# EAGLE design AE-UM232R (EAGLE 5.10)
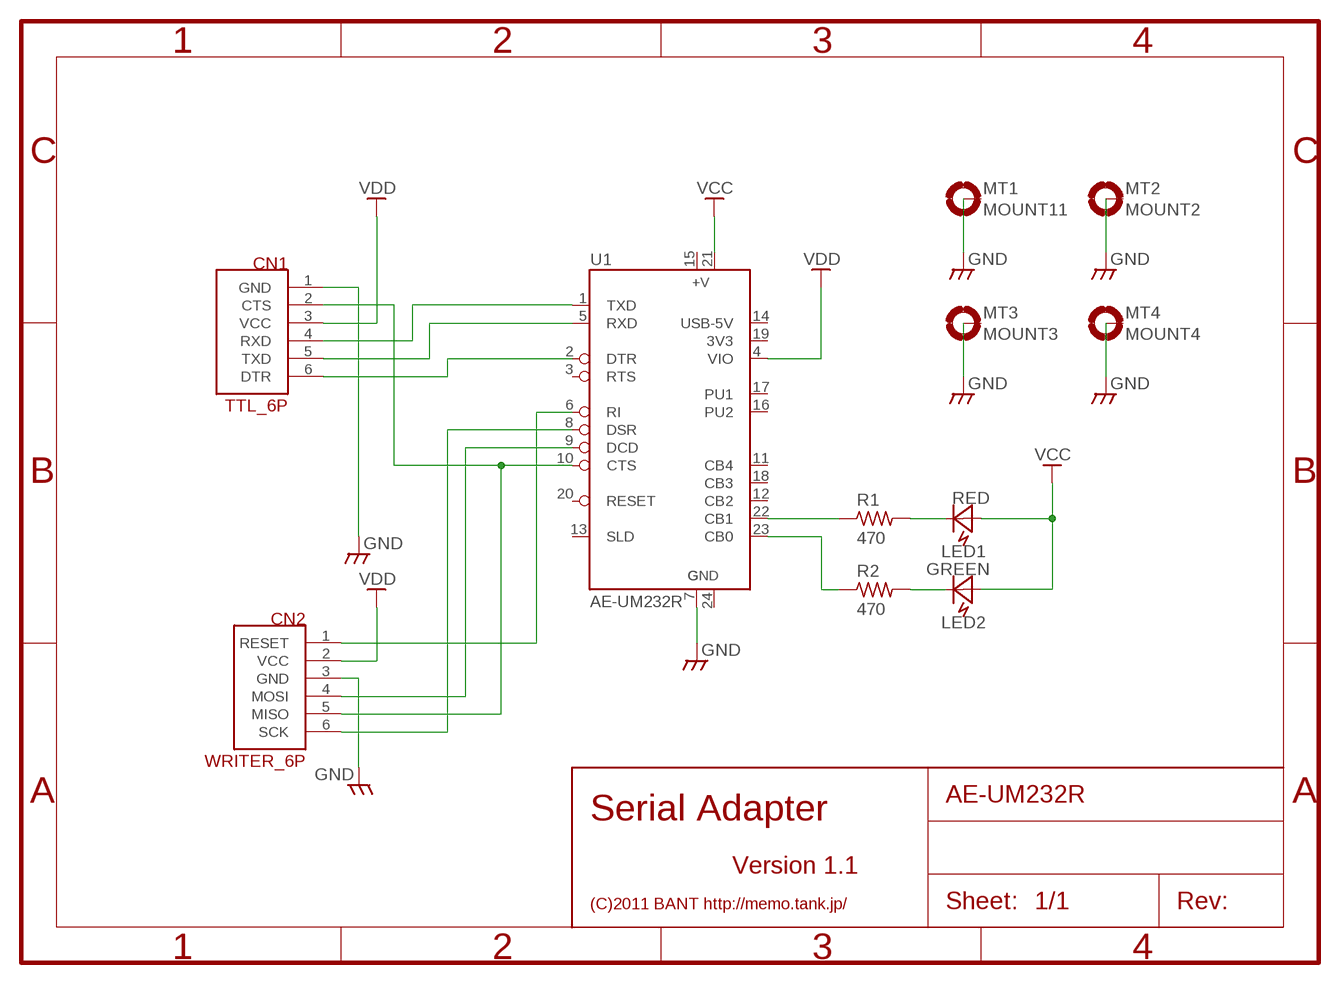
[diagram p0: schematic, sheet 1]

## Parts
CN1  TTL_6P  ARDUINO_TTL_6P  [CON_HRS_DIP_6]
CN2  WRITER_6P  HIDASPX_CON_6P  [CON_HRS_DIP_6]
LED1  RED  LED  [LED_3MM_VIRT_2]
LED2  GREEN  LED  [LED_3MM_VIRT_2]
MT1  MOUNT11  MOUNT-PAD2.1  [PAD-2.1]
MT2  MOUNT2  MOUNT-PAD2.1  [PAD-2.1]
MT3  MOUNT3  MOUNT-PAD2.1  [PAD-2.1]
MT4  MOUNT4  MOUNT-PAD2.1  [PAD-2.1]
R1  470  R0.125W_4P  [R_0.125W_4]
R2  470  R0.125W_4P  [R_0.125W_4]
U1  AE-UM232R  [DIL24-6]

## Nets
GND: CN1.1(GND) CN2.3(GND) MT1.B2,1(MOUNT) MT2.B2,1(MOUNT) MT3.B2,1(MOUNT) MT4.B2,1(MOUNT) U1.7(GND)
N$1: R1.1 U1.22(CB1)
N$2: CN2.6(SCK) U1.8(DSR)
N$3: CN1.2(CTS) CN2.5(MISO) U1.10(CTS)
N$4: CN1.6(DTR) U1.2(DTR)
N$7: CN2.1(RESET) U1.6(RI)
N$8: CN2.4(MOSI) U1.9(DCD)
N$10: LED1.K R1.2
N$11: R2.1 U1.23(CB0)
N$12: LED2.K R2.2
N$13: CN1.5(TXD) U1.5(RXD)
N$14: CN1.4(RXD) U1.1(TXD)
VCC: LED1.A LED2.A U1.21(VCC)
VDD: CN1.3(VCC) CN2.2(VCC) U1.4(VIO)
Unconnected: U1.3(RTS) U1.11(CB4) U1.12(CB2) U1.13(SLD) U1.14(USB-5V) U1.15(VCC) U1.16(PU2) U1.17(PU1) U1.18(CB3) U1.19(3V3) U1.20(RESET) U1.24(GND)

## Notes on the sheet
- Serial Adapter
- Version 1.1
- (C)2011 BANT http://memo.tank.jp/

## Library data of the parts
CN1 = bant2:ARDUINO_TTL_6P
CN2 = bant:HIDASPX_CON_6P
LED1 LED2 = MyLib:LED: 3mm LED
MT1-MT4 = MyLib:MOUNT-PAD: 2.1mm Mount Pad (Connectable to GND)
R1 R2 = MyLib:R: General Resiter 1/8W 1/4W 1/2W V/H
U1 = akizuki:AE-UM232R: Akizuki USB-Serial Converter (TTL-Level)

## Board
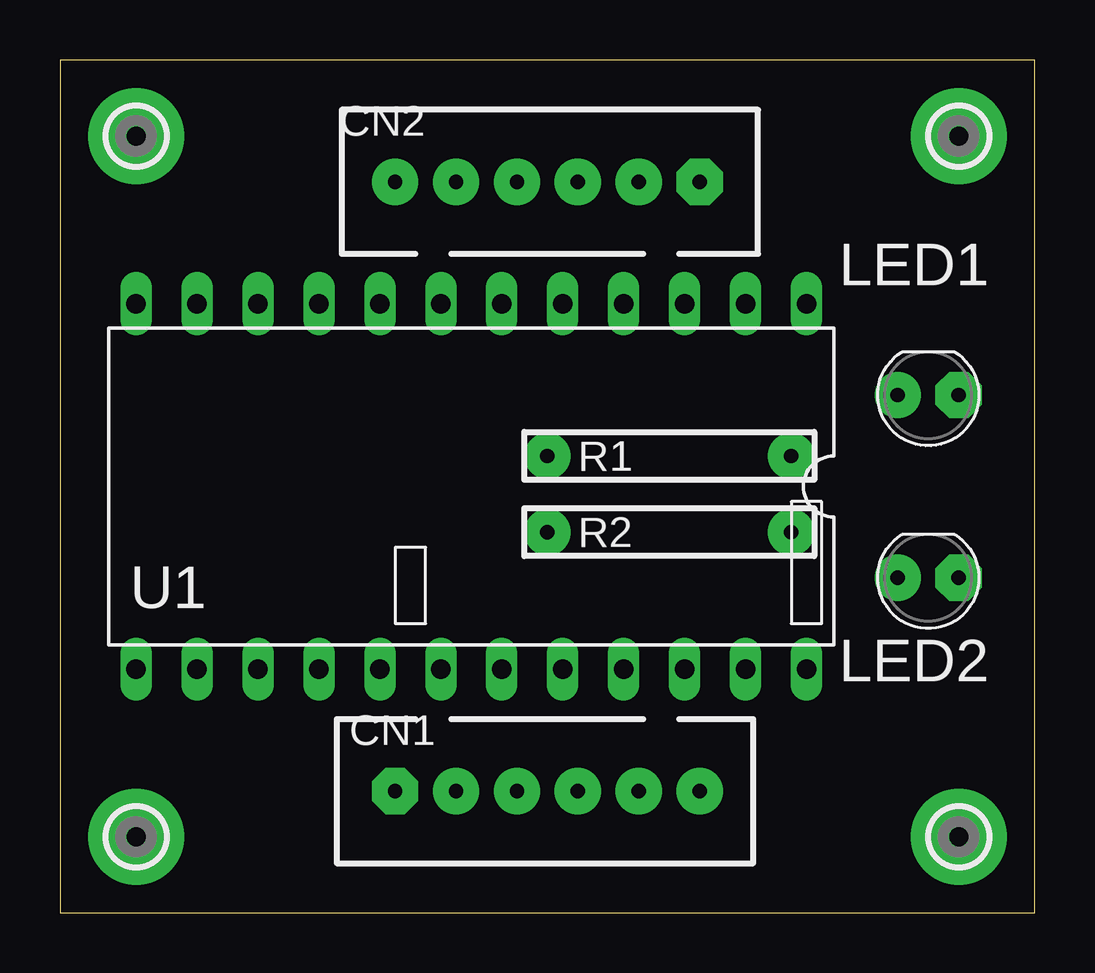
[diagram p1: board, top side]
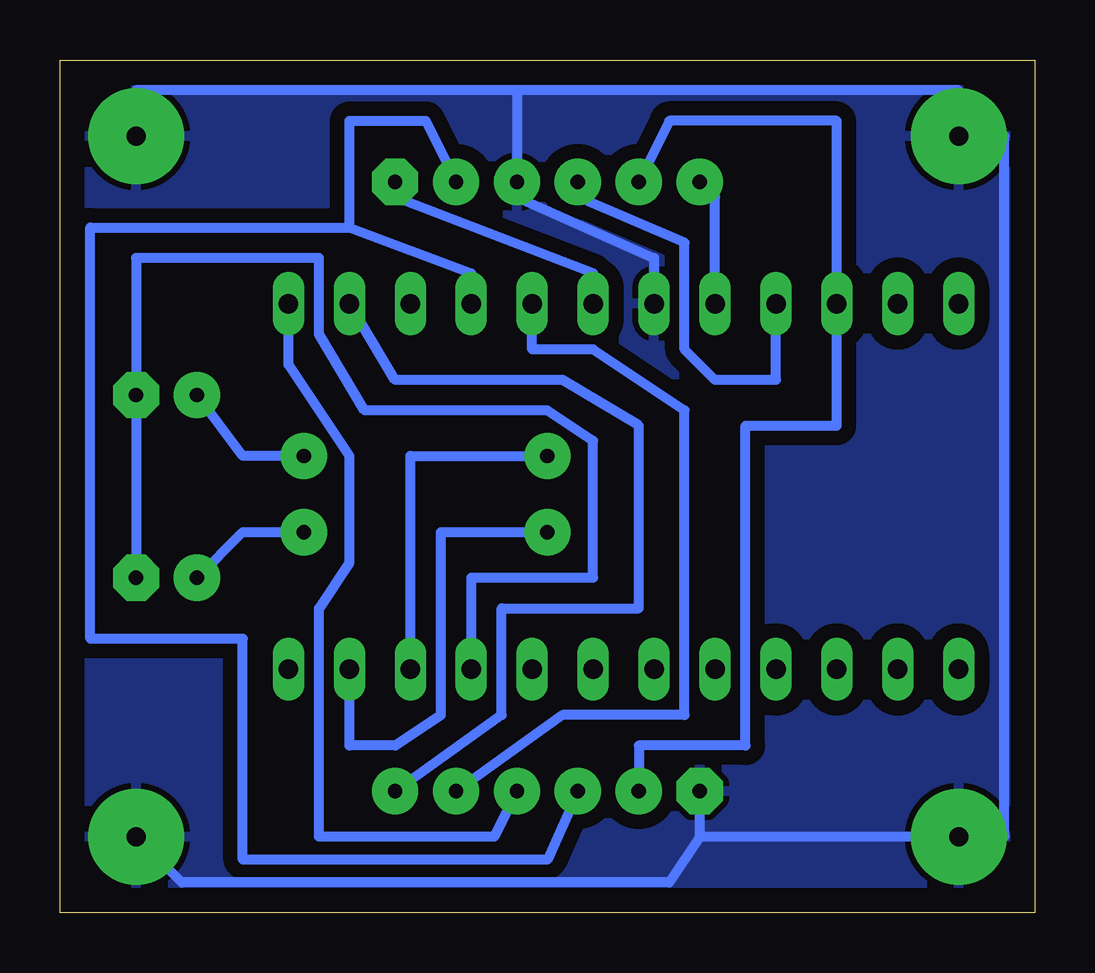
[diagram p2: board, bottom side, seen from below]

Size 40.64 x 35.56 mm. Coordinates in mm from the lower left corner, seen from the top.
Outline: 0,0 40.64,0 40.64,35.56 0,35.56 0,0
Copper layers (1*16): Top 0.035mm / dielectric 1.5mm / Bottom 0.035mm
Design rules "default": minimum track width 10mil, minimum drill 24mil, track to track 8mil, track to pad 8mil, pad to pad 8mil, via to via 8mil, smd to smd 8mil, copper to edge 40mil, drill to drill 8mil, minimum pad ring 10mil, minimum via ring 8mil, stop-mask expansion 4mil, vias tented up to drill 0mil, thermal gap 10mil

### Footprints (pad centres in the part's own frame; a part is rotated, then mirrored left to right if it is on the bottom)
CON_HRS_DIP_6 = drill 0.6 pad 1.93 octagon: 1 -6.35,0 | drill 0.6 pad 1.93 round: 2 -3.81,0; 3 -1.27,0; 4 1.27,0; 5 3.81,0; 6 6.35,0
LED_3MM_VIRT_2 = drill 0.6 pad 1.93 octagon: A -1.27,0 | drill 0.6 pad 1.93 round: K 1.27,0
PAD-2.1 = drill 0.8 pad 4 round: B2,1 0,0
R_0.125W_4 = drill 0.6 pad 1.93 round: 1 -5.08,0; 2 5.08,0
DIL24-6 = drill 0.813 long: 1 -13.97,-7.62; 2 -11.43,-7.62; 3 -8.89,-7.62; 4 -6.35,-7.62; 5 -3.81,-7.62; 6 -1.27,-7.62; 7 1.27,-7.62; 8 3.81,-7.62; 9 6.35,-7.62; 10 8.89,-7.62; 11 11.43,-7.62; 12 13.97,-7.62; 13 13.97,7.62; 14 11.43,7.62; 15 8.89,7.62; 16 6.35,7.62; 17 3.81,7.62; 18 1.27,7.62; 19 -1.27,7.62; 20 -3.81,7.62; 21 -6.35,7.62; 22 -8.89,7.62; 23 -11.43,7.62; 24 -13.97,7.62

### Placement (x,y rotation side)
CN1  20.32,5.08 0 top
CN2  20.32,30.48 180 top
LED1  36.2,21.59 180 top
LED2  36.2,13.97 180 top
MT1  3.17,3.17 0 top
MT2  37.47,3.17 0 top
MT3  37.47,32.38 0 top
MT4  3.17,32.38 0 top
R1  25.4,19.05 0 top
R2  25.4,15.88 0 top
U1  17.14,17.78 180 top

### Tracks (layer width: path | path; a pad name or v marks a point on that pad's centre or on a via)
GND
  Bottom 0.406: 13.97,3.17 MT1.B2,1 1.27,3.17 1.27,32.38 MT4.B2,1 3.17,34.29 21.59,34.29 | MT2.B2,1 35.56,1.27 15.24,1.27 13.97,3.17 | 13.97,3.17 CN1.1 | U1.7 15.88,27.3 21.59,29.84 CN2.3 21.59,34.29 | 21.59,34.29 37.47,34.29 MT3.B2,1
  pour Bottom (isolate 0.61): 0,35.56 0,0 40.64,0 40.64,35.56
N$1
  Bottom 0.406: U1.22 26.04,19.05 R1.1
N$2
  Bottom 0.406: U1.8 13.34,29.84 CN2.6
N$3
  Bottom 0.406: CN2.5 15.24,33.02 8.26,33.02 U1.10 8.26,20.32 12.06,20.32 12.06,6.99 16.51,6.99 CN1.2
N$4
  Bottom 0.406: U1.2 26.67,22.23 19.68,22.23 16.51,20.32 16.51,12.7 22.23,12.7 22.23,8.26 CN1.6
N$7
  Bottom 0.406: U1.6 18.41,26.67 26.67,29.84 CN2.1
N$8
  Bottom 0.406: U1.9 10.79,22.23 13.34,22.23 14.61,23.5 14.61,27.94 19.05,29.84 CN2.4
N$10
  Bottom 0.406: R1.2 33.02,19.05 LED1.K
N$11
  Bottom 0.406: U1.23 28.57,6.99 26.67,6.99 24.77,8.26 24.77,15.88 R2.1
N$12
  Bottom 0.406: LED2.K 33.02,15.88 R2.2
N$13
  Bottom 0.406: U1.5 20.95,23.5 18.41,23.5 14.61,20.95 14.61,8.26 19.68,8.26 CN1.5
N$14
  Bottom 0.406: U1.1 31.11,22.86 28.57,19.05 28.57,14.61 29.84,12.7 29.84,3.17 22.54,3.17 CN1.4
VCC
  Bottom 0.406: U1.21 23.5,13.97 18.41,13.97 18.41,19.68 20.32,20.95 27.94,20.95 29.84,24.13 29.84,27.3 37.47,27.3 LED1.A LED2.A
VDD
  Bottom 0.406: 28.57,28.57 23.5,26.67 U1.4 | 28.57,28.57 28.57,33.02 25.4,33.02 CN2.2 | CN1.3 20.32,2.22 33.02,2.22 33.02,11.43 39.37,11.43 39.37,28.57 28.57,28.57